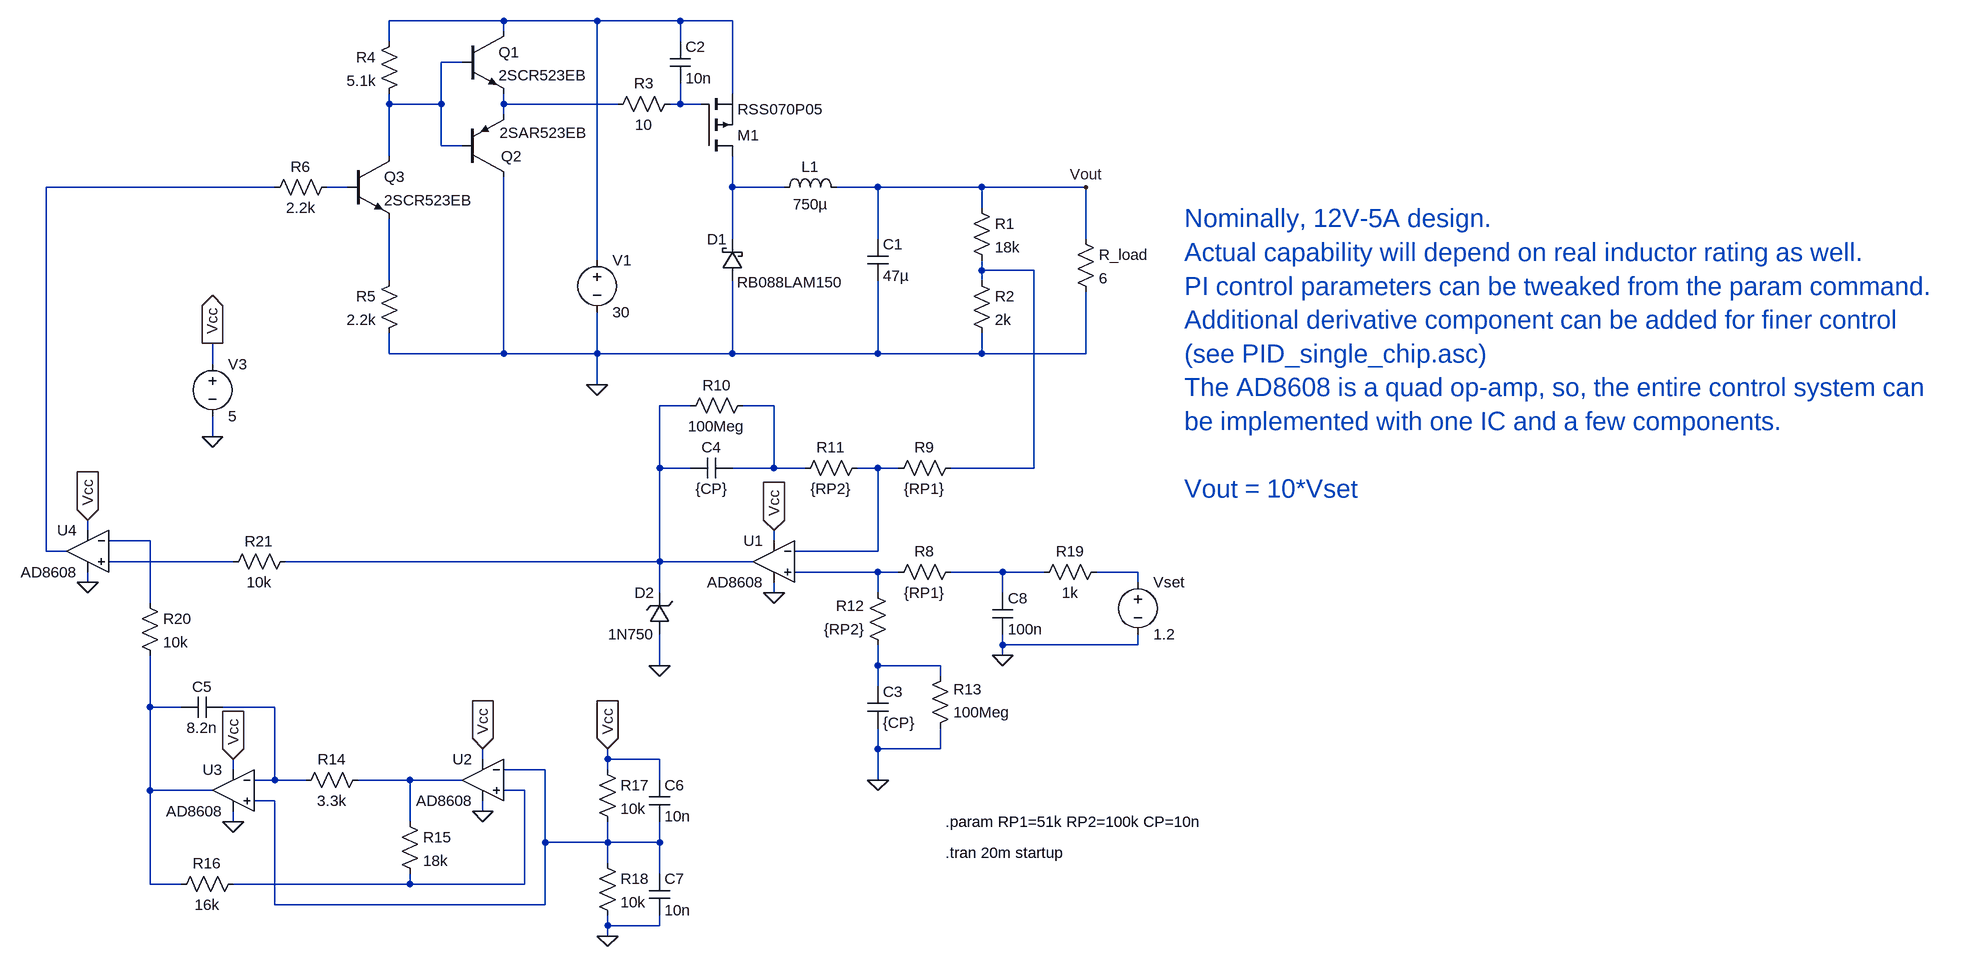
[diagram p0: schematic SMPS_Buck.asc]
SMPS_Buck.asc, the LTspice schematic file:
Version 4
SHEET 1 1820 1204
WIRE -496 -224 -672 -224
WIRE -352 -224 -496 -224
WIRE -224 -224 -352 -224
WIRE -144 -224 -224 -224
WIRE -496 -208 -496 -224
WIRE -672 -192 -672 -224
WIRE -224 -192 -224 -224
WIRE -560 -160 -592 -160
WIRE -144 -112 -144 -224
WIRE -672 -96 -672 -112
WIRE -592 -96 -592 -160
WIRE -592 -96 -672 -96
WIRE -496 -96 -496 -112
WIRE -320 -96 -496 -96
WIRE -224 -96 -224 -128
WIRE -224 -96 -240 -96
WIRE -192 -96 -224 -96
WIRE -496 -80 -496 -96
WIRE -592 -32 -592 -96
WIRE -560 -32 -592 -32
WIRE -672 -16 -672 -96
WIRE -848 32 -1200 32
WIRE -736 32 -768 32
WIRE -144 32 -144 -16
WIRE -64 32 -144 32
WIRE 80 32 16 32
WIRE 240 32 80 32
WIRE 400 32 240 32
WIRE 240 64 240 32
WIRE -144 112 -144 32
WIRE 80 112 80 32
WIRE 400 112 400 32
WIRE -352 144 -352 -224
WIRE 240 160 240 144
WIRE 320 160 240 160
WIRE -672 176 -672 80
WIRE 240 176 240 160
WIRE -672 288 -672 256
WIRE -496 288 -496 16
WIRE -496 288 -672 288
WIRE -352 288 -352 224
WIRE -352 288 -496 288
WIRE -144 288 -144 176
WIRE -144 288 -352 288
WIRE 80 288 80 176
WIRE 80 288 -144 288
WIRE 240 288 240 256
WIRE 240 288 80 288
WIRE 400 288 400 192
WIRE 400 288 240 288
WIRE -944 304 -944 272
WIRE -352 336 -352 288
WIRE -208 368 -256 368
WIRE -80 368 -128 368
WIRE -944 416 -944 384
WIRE -256 464 -256 368
WIRE -208 464 -256 464
WIRE -80 464 -80 368
WIRE -80 464 -144 464
WIRE -32 464 -80 464
WIRE 80 464 48 464
WIRE 112 464 80 464
WIRE 320 464 320 160
WIRE 320 464 192 464
WIRE -1136 560 -1136 544
WIRE -1040 576 -1104 576
WIRE -80 576 -80 560
WIRE -1200 592 -1200 32
WIRE -1168 592 -1200 592
WIRE 80 592 80 464
WIRE 80 592 -48 592
WIRE -912 608 -1104 608
WIRE -256 608 -256 464
WIRE -256 608 -832 608
WIRE -112 608 -256 608
WIRE 80 624 -48 624
WIRE 112 624 80 624
WIRE 272 624 192 624
WIRE 336 624 272 624
WIRE 480 624 416 624
WIRE -1136 640 -1136 624
WIRE 480 640 480 624
WIRE -256 656 -256 608
WIRE -80 656 -80 640
WIRE 80 656 80 624
WIRE 272 656 272 624
WIRE -1040 672 -1040 576
WIRE 272 736 272 720
WIRE 480 736 480 720
WIRE 480 736 272 736
WIRE 272 752 272 736
WIRE -256 768 -256 720
WIRE 80 768 80 736
WIRE 176 768 80 768
WIRE 176 784 176 768
WIRE 80 800 80 768
WIRE -1040 832 -1040 752
WIRE -992 832 -1040 832
WIRE -848 832 -928 832
WIRE 80 896 80 864
WIRE 176 896 176 864
WIRE 176 896 80 896
WIRE -528 912 -528 896
WIRE -336 912 -336 896
WIRE -256 912 -336 912
WIRE -912 928 -912 912
WIRE -432 928 -496 928
WIRE -336 928 -336 912
WIRE -848 944 -848 832
WIRE -848 944 -880 944
WIRE -800 944 -848 944
WIRE -640 944 -720 944
WIRE -560 944 -640 944
WIRE -256 944 -256 912
WIRE 80 944 80 896
WIRE -1040 960 -1040 832
WIRE -944 960 -1040 960
WIRE -464 960 -496 960
WIRE -848 976 -880 976
WIRE -528 992 -528 976
WIRE -912 1008 -912 992
WIRE -640 1008 -640 944
WIRE -432 1040 -432 928
WIRE -336 1040 -336 1008
WIRE -336 1040 -432 1040
WIRE -256 1040 -256 1008
WIRE -256 1040 -336 1040
WIRE -336 1072 -336 1040
WIRE -256 1088 -256 1040
WIRE -1040 1104 -1040 960
WIRE -992 1104 -1040 1104
WIRE -640 1104 -640 1088
WIRE -640 1104 -912 1104
WIRE -464 1104 -464 960
WIRE -464 1104 -640 1104
WIRE -848 1136 -848 976
WIRE -432 1136 -432 1040
WIRE -432 1136 -848 1136
WIRE -336 1168 -336 1152
WIRE -256 1168 -256 1152
WIRE -256 1168 -336 1168
WIRE -336 1184 -336 1168
FLAG -352 336 0
FLAG -80 560 Vcc
IOPIN -80 560 In
FLAG -80 656 0
FLAG 80 944 0
FLAG -528 896 Vcc
IOPIN -528 896 In
FLAG -528 992 0
FLAG -912 912 Vcc
IOPIN -912 912 In
FLAG -912 1008 0
FLAG -336 896 Vcc
IOPIN -336 896 In
FLAG -336 1184 0
FLAG 272 752 0
FLAG -1136 544 Vcc
IOPIN -1136 544 In
FLAG -1136 640 0
FLAG -944 272 Vcc
IOPIN -944 272 Out
FLAG -944 416 0
FLAG -256 768 0
FLAG 400 32 Vout
SYMBOL pmos -192 -16 M180
SYMATTR InstName M1
SYMATTR Value RSS070P05
SYMBOL schottky -128 176 R180
WINDOW 0 24 64 Left 2
WINDOW 3 -155 -2 Left 2
SYMATTR InstName D1
SYMATTR Value RB088LAM150
SYMATTR Description Diode
SYMATTR Type diode
SYMBOL ind -80 48 R270
WINDOW 0 32 56 VTop 2
WINDOW 3 5 56 VBottom 2
SYMATTR InstName L1
SYMATTR Value 750µ
SYMATTR SpiceLine Rser=10m
SYMBOL cap 64 112 R0
SYMATTR InstName C1
SYMATTR Value 47µ
SYMBOL res 224 48 R0
SYMATTR InstName R1
SYMATTR Value 18k
SYMBOL res 224 160 R0
SYMATTR InstName R2
SYMATTR Value 2k
SYMBOL voltage -352 128 R0
WINDOW 123 0 0 Left 0
WINDOW 39 0 0 Left 0
SYMATTR InstName V1
SYMATTR Value 30
SYMBOL npn -560 -208 R0
SYMATTR InstName Q1
SYMATTR Value 2SCR523EB
SYMBOL pnp -560 16 M180
WINDOW 0 60 32 Left 2
WINDOW 3 58 68 Left 2
SYMATTR InstName Q2
SYMATTR Value 2SAR523EB
SYMBOL res -224 -112 R90
WINDOW 0 0 56 VBottom 2
WINDOW 3 32 56 VTop 2
SYMATTR InstName R3
SYMATTR Value 10
SYMBOL res -656 -208 M0
SYMATTR InstName R4
SYMATTR Value 5.1k
SYMBOL res -656 160 M0
SYMATTR InstName R5
SYMATTR Value 2.2k
SYMBOL npn -736 -16 R0
SYMATTR InstName Q3
SYMATTR Value 2SCR523EB
SYMBOL res -752 16 R90
WINDOW 0 0 56 VBottom 2
WINDOW 3 32 56 VTop 2
SYMATTR InstName R6
SYMATTR Value 2.2k
SYMBOL cap -240 -192 R0
SYMATTR InstName C2
SYMATTR Value 10n
SYMBOL res 384 96 R0
SYMATTR InstName R_load
SYMATTR Value 6
SYMBOL res 208 608 R90
WINDOW 0 0 56 VBottom 2
WINDOW 3 32 56 VTop 2
SYMATTR InstName R8
SYMATTR Value {RP1}
SYMBOL res 208 448 R90
WINDOW 0 0 56 VBottom 2
WINDOW 3 32 56 VTop 2
SYMATTR InstName R9
SYMATTR Value {RP1}
SYMBOL res -112 352 R90
WINDOW 0 0 56 VBottom 2
WINDOW 3 32 56 VTop 2
SYMATTR InstName R10
SYMATTR Value 100Meg
SYMBOL res 64 448 R90
WINDOW 0 0 56 VBottom 2
WINDOW 3 32 56 VTop 2
SYMATTR InstName R11
SYMATTR Value {RP2}
SYMBOL res 96 752 R180
WINDOW 0 36 76 Left 2
WINDOW 3 36 40 Left 2
SYMATTR InstName R12
SYMATTR Value {RP2}
SYMBOL res 160 880 M180
WINDOW 0 36 76 Left 2
WINDOW 3 36 40 Left 2
SYMATTR InstName R13
SYMATTR Value 100Meg
SYMBOL cap 64 800 R0
SYMATTR InstName C3
SYMATTR Value {CP}
SYMBOL cap -144 448 R90
WINDOW 0 0 32 VBottom 2
WINDOW 3 32 32 VTop 2
SYMATTR InstName C4
SYMATTR Value {CP}
SYMBOL OpAmps\\AD8608 -528 880 M0
SYMATTR InstName U2
SYMBOL OpAmps\\AD8608 -912 896 M0
SYMATTR InstName U3
SYMBOL res -704 928 R90
WINDOW 0 0 56 VBottom 2
WINDOW 3 32 56 VTop 2
SYMATTR InstName R14
SYMATTR Value 3.3k
SYMBOL res -656 992 R0
SYMATTR InstName R15
SYMATTR Value 18k
SYMBOL cap -928 816 R90
WINDOW 0 0 32 VBottom 2
WINDOW 3 32 32 VTop 2
SYMATTR InstName C5
SYMATTR Value 8.2n
SYMBOL res -896 1088 R90
WINDOW 0 0 56 VBottom 2
WINDOW 3 32 56 VTop 2
SYMATTR InstName R16
SYMATTR Value 16k
SYMBOL res -352 912 R0
SYMATTR InstName R17
SYMATTR Value 10k
SYMBOL res -352 1056 R0
SYMATTR InstName R18
SYMATTR Value 10k
SYMBOL cap -272 944 R0
SYMATTR InstName C6
SYMATTR Value 10n
SYMBOL cap -272 1088 R0
SYMATTR InstName C7
SYMATTR Value 10n
SYMBOL cap 256 656 R0
SYMATTR InstName C8
SYMATTR Value 100n
SYMBOL res 432 608 R90
WINDOW 0 0 56 VBottom 2
WINDOW 3 32 56 VTop 2
SYMATTR InstName R19
SYMATTR Value 1k
SYMBOL voltage 480 624 R0
WINDOW 123 0 0 Left 0
WINDOW 39 0 0 Left 0
SYMATTR InstName Vset
SYMATTR Value 1.2
SYMBOL OpAmps\\AD8608 -1136 528 M0
SYMATTR InstName U4
SYMBOL res -1056 656 R0
SYMATTR InstName R20
SYMATTR Value 10k
SYMBOL res -816 592 R90
WINDOW 0 0 56 VBottom 2
WINDOW 3 32 56 VTop 2
SYMATTR InstName R21
SYMATTR Value 10k
SYMBOL voltage -944 288 R0
WINDOW 123 0 0 Left 0
WINDOW 39 0 0 Left 0
SYMATTR InstName V3
SYMATTR Value 5
SYMBOL zener -240 720 R180
WINDOW 0 24 64 Left 2
WINDOW 3 24 0 Left 2
SYMATTR InstName D2
SYMATTR Value 1N750
SYMATTR Description Diode
SYMATTR Type diode
SYMBOL OpAmps\\AD8608 -80 544 M0
SYMATTR InstName U1
TEXT 184 1056 Left 2 !.tran 20m startup
TEXT 184 1008 Left 2 !.param RP1=51k RP2=100k CP=10n
TEXT 552 80 Left 4 ;Nominally, 12V-5A design.\nActual capability will depend on real inductor rating as well.\nPI control parameters can be tweaked from the param command.\nAdditional derivative component can be added for finer control\n(see PID_single_chip.asc)\nThe AD8608 is a quad op-amp, so, the entire control system can\nbe implemented with one IC and a few components.\n \nVout = 10*Vset

The netlist it stands for:
* SMPS_Buck.asc
M1 N007 N004 N001 N001 RSS070P05
D1 0 N007 RB088LAM150
L1 N007 Vout 750µ Rser=10m
C1 Vout 0 47µ
R1 Vout N008 18k
R2 N008 0 2k
V1 N001 0 30
Q1 N001 N002 N003 0 2SCR523EB
Q2 0 N002 N003 0 2SAR523EB
R3 N004 N003 10
R4 N001 N002 5.1k
R5 N009 0 2.2k
Q3 N002 N006 N009 0 2SCR523EB
R6 N006 N005 2.2k
C2 N001 N004 10n
R_load Vout 0 6
R8 N016 N015 {RP1}
R9 N008 N012 {RP1}
R10 N011 N010 100Meg
R11 N012 N011 {RP2}
R12 N018 N015 {RP2}
R13 0 N018 100Meg
C3 N018 0 {CP}
C4 N011 N010 {CP}
XU2 N023 N021 Vcc 0 N022 AD8608  ; pins In+ In- V+ V- OUT
XU3 N021 N020 Vcc 0 N019 AD8608  ; pins In+ In- V+ V- OUT
R14 N022 N020 3.3k
R15 N022 N023 18k
C5 N020 N019 8.2n
R16 N023 N019 16k
R17 Vcc N021 10k
R18 N021 0 10k
C6 Vcc N021 10n
C7 N021 0 10n
C8 N016 0 100n
R19 N017 N016 1k
Vset N017 0 1.2
XU4 N014 N013 Vcc 0 N005 AD8608  ; pins In+ In- V+ V- OUT
R20 N013 N019 10k
R21 N010 N014 10k
V3 Vcc 0 5
D2 0 N010 1N750
XU1 N015 N012 Vcc 0 N010 AD8608  ; pins In+ In- V+ V- OUT
.model D D
.lib standard.dio
.model NPN NPN
.model PNP PNP
.lib standard.bjt
.model NMOS NMOS
.model PMOS PMOS
.lib standard.mos
.tran 20m startup
.param RP1=51k RP2=100k CP=10n
* Nominally, 12V-5A design.
* Actual capability will depend on real inductor rating as well.
* PI control parameters can be tweaked from the param command.
* Additional derivative component can be added for finer control
* (see PID_single_chip.asc)
* The AD8608 is a quad op-amp, so, the entire control system can
* be implemented with one IC and a few components.
* Vout = 10*Vset
.backanno
.end